# EAGLE design OptronV7_PCB (EAGLE 9.5.1)
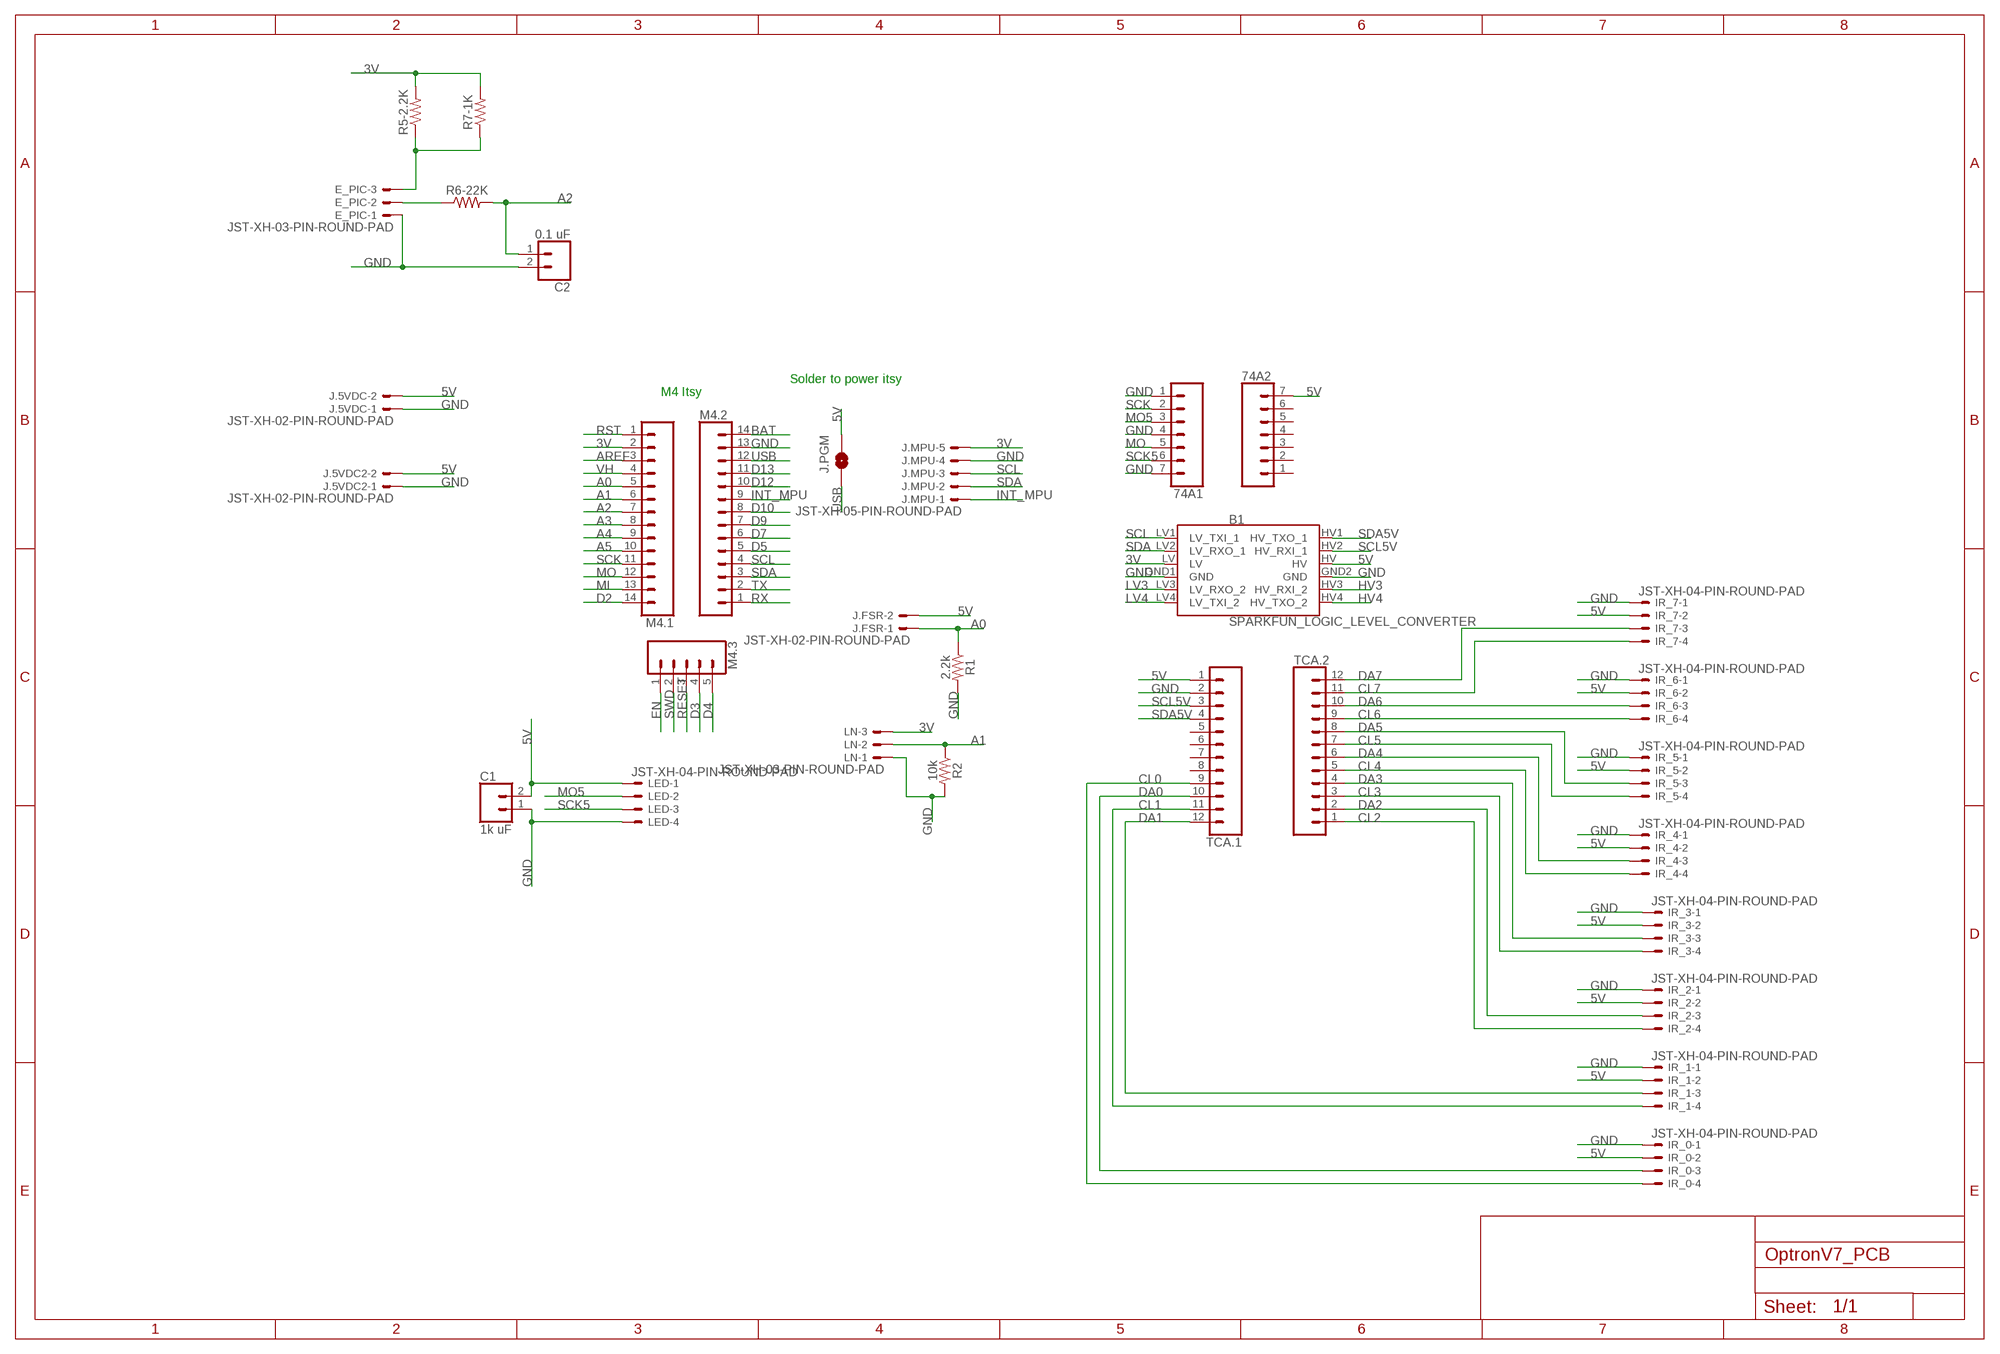
[diagram p0: schematic, sheet 1]

## Parts
74A1  CONN_07  [1X07]
74A2  CONN_07  [1X07]
B1  SPARKFUN_LOGIC_LEVEL_CONVERTER  [SPARKFUN_LOGIC_LEVEL_CONVERTER]
C1  1k uF  CONN_02  [1X02]
C2  0.1 uF  CONN_02  [1X02]
E_PIC  JST-XH-03-PIN-ROUND-PAD  [JST-XH-03-PACKAGE-ROUND-PAD]
IR_0  JST-XH-04-PIN-ROUND-PAD  [JST-XH-04-PACKAGE-ROUND-PAD]
IR_1  JST-XH-04-PIN-ROUND-PAD  [JST-XH-04-PACKAGE-ROUND-PAD]
IR_2  JST-XH-04-PIN-ROUND-PAD  [JST-XH-04-PACKAGE-ROUND-PAD]
IR_3  JST-XH-04-PIN-ROUND-PAD  [JST-XH-04-PACKAGE-ROUND-PAD]
IR_4  JST-XH-04-PIN-ROUND-PAD  [JST-XH-04-PACKAGE-ROUND-PAD]
IR_5  JST-XH-04-PIN-ROUND-PAD  [JST-XH-04-PACKAGE-ROUND-PAD]
IR_6  JST-XH-04-PIN-ROUND-PAD  [JST-XH-04-PACKAGE-ROUND-PAD]
IR_7  JST-XH-04-PIN-ROUND-PAD  [JST-XH-04-PACKAGE-ROUND-PAD]
J.5VDC  JST-XH-02-PIN-ROUND-PAD  [JST-XH-02-PACKAGE-ROUND-PAD]
J.5VDC2  JST-XH-02-PIN-ROUND-PAD  [JST-XH-02-PACKAGE-ROUND-PAD]
J.FSR  JST-XH-02-PIN-ROUND-PAD  [JST-XH-02-PACKAGE-ROUND-PAD]
J.MPU  JST-XH-05-PIN-ROUND-PAD  [JST-XH-05-PACKAGE-ROUND-PAD]
J.PGM  JUMPER-SMT_2_NO_NO-SILK  [SMT-JUMPER_2_NO_NO-SILK]
LED  JST-XH-04-PIN-ROUND-PAD  [JST-XH-04-PACKAGE-ROUND-PAD]
LN  JST-XH-03-PIN-ROUND-PAD  [JST-XH-03-PACKAGE-ROUND-PAD]
M4.1  CONN_14  [1X14]
M4.2  CONN_14  [1X14]
M4.3  CONN_05  [1X05]
R1  2.2k  10KOHM-HORIZ-1/4W-5%  [AXIAL-0.3]
R2  10k  10KOHM-HORIZ-1/4W-5%  [AXIAL-0.3]
R5-2.2K  RESISTORAXIAL-0.3  [AXIAL-0.3]
R6-22K  RESISTORAXIAL-0.3  [AXIAL-0.3]
R7-1K  RESISTORAXIAL-0.3  [AXIAL-0.3]
TCA.1  CONN_12  [1X12]
TCA.2  CONN_12  [1X12]

## Nets
3V: B1.LV J.MPU.5 LN.3 M4.1.2 R5-2.2K.P$2 R7-1K.P$2
5V: 74A2.7 B1.HV C1.2 IR_0.2 IR_1.2 IR_2.2 IR_3.2 IR_4.2 IR_5.2 IR_6.2 IR_7.2 J.5VDC2.2 J.5VDC.2 J.FSR.2 J.PGM.2 LED.1 TCA.1.1
A0: J.FSR.1 M4.1.5 R1.P$1
A1: LN.2 M4.1.6 R2.P$1
A2: C2.1 M4.1.7 R6-22K.P$2
A3: M4.1.8
A4: M4.1.9
A5: M4.1.10
AREF: M4.1.3
BAT: M4.2.14
CL0: IR_0.4 TCA.1.9
CL1: IR_1.4 TCA.1.11
CL2: IR_2.4 TCA.2.1
CL3: IR_3.4 TCA.2.3
CL4: IR_4.4 TCA.2.5
CL5: IR_5.4 TCA.2.7
CL6: IR_6.4 TCA.2.9
CL7: IR_7.4 TCA.2.11
D2: M4.1.14
D3: M4.3.4
D4: M4.3.5
D5: M4.2.5
D7: M4.2.6
D9: M4.2.7
D10: M4.2.8
D12: M4.2.10
D13: M4.2.11
DA0: IR_0.3 TCA.1.10
DA1: IR_1.3 TCA.1.12
DA2: IR_2.3 TCA.2.2
DA3: IR_3.3 TCA.2.4
DA4: IR_4.3 TCA.2.6
DA5: IR_5.3 TCA.2.8
DA6: IR_6.3 TCA.2.10
DA7: IR_7.3 TCA.2.12
EN: M4.3.1
GND: 74A1.1 74A1.4 74A1.7 B1.GND1(GND) B1.GND2(GND) C1.1 C2.2 E_PIC.1 IR_0.1 IR_1.1 IR_2.1 IR_3.1 IR_4.1 IR_5.1 IR_6.1 IR_7.1 J.5VDC2.1 J.5VDC.1 J.MPU.4 LED.4 LN.1 M4.2.13 R1.P$2 R2.P$2 TCA.1.2
HV3: B1.HV3(HV_RXI_2)
HV4: B1.HV4(HV_TXO_2)
INT_MPU: J.MPU.1 M4.2.9
LV3: B1.LV3(LV_RXO_2)
LV4: B1.LV4(LV_TXI_2)
MI: M4.1.13
MO: 74A1.5 M4.1.12
MO5: 74A1.3 LED.2
N$2: E_PIC.3 R5-2.2K.P$1 R7-1K.P$1
N$3: E_PIC.2 R6-22K.P$1
RESET: M4.3.3
RST: M4.1.1
RX: M4.2.1
SCK: 74A1.2 M4.1.11
SCK5: 74A1.6 LED.3
SCL: B1.LV1(LV_TXI_1) J.MPU.3 M4.2.4
SCL5V: B1.HV2(HV_RXI_1) TCA.1.3
SDA: B1.LV2(LV_RXO_1) J.MPU.2 M4.2.3
SDA5V: B1.HV1(HV_TXO_1) TCA.1.4
SWD: M4.3.2
TX: M4.2.2
USB: J.PGM.1 M4.2.12
VH: M4.1.4
Unconnected: 74A2.1 74A2.2 74A2.3 74A2.4 74A2.5 74A2.6 TCA.1.5 TCA.1.6 TCA.1.7 TCA.1.8

## Notes on the sheet
- Solder to power itsy
- M4 Itsy

## Library data of the parts
74A1 74A2 = SparkFun-Connectors:CONN_07: Multi connection point. Often used as Generic Header-pin footprint for 0.1 inch spaced/style header connections On any of the 0.1 inch spaced packages, you can populate with these: Break Away Headers - Straight <https://www.sparkfun.com/products/116> (PRT-00116) Break Away Male Headers - Right Angle <https://www.sparkfun.com/products/553> (PRT-00553) Female Headers <https://www.sparkfun.com/products/115> (PRT-00115) Break Away Headers - Machine Pin <https://www.sparkfun.com/products/117> (PRT-00117) Break Away Female Headers - Swiss Machine Pin <https://www.sparkfun.com/products/743> (PRT-00743) For SCREWTERMINALS and SPRING TERMINALS visit here: Screw Terimnals on SparkFun.com <https://www.sparkfun.com/search/results?term=Screw+Terminals> (5mm/3.5mm/2.54mm spacing) This device is also useful as a general connection point to wire up your design to another part of your project. Our various solder wires solder well into these plated through hole pads. Hook-Up Wire - Assortment (Stranded, 22 AWG) <https://www.sparkfun.com/products/11375> (PRT-11375) Hook-Up Wire - Assortment (Solid Core, 22 AWG) <https://www.sparkfun.com/products/11367> (PRT-11367) View the entire wire category on our website here <https://www.sparkfun.com/categories/141> Special notes: Molex polarized connector foot print use with SKU : PRT-08231 with associated crimp pins and housings. 1MM SMD Version SKU: PRT-10208 NOTES ON THE VARIANTS LOCK and LOCK_LONGPADS... This footprint was designed to help hold the alignment of a through-hole component (i.e. 6-pin header) while soldering it into place. You may notice that each hole has been shifted either up or down by 0.005 of an inch from it's more standard position (which is a perfectly straight line). This slight alteration caused the pins (the squares in the middle) to touch the edges of the holes. Because they are alternating, it causes a "brace" to hold the component in place. 0.005 has proven to be the perfect amount of "off-center" position when using our standard breakaway headers. Although looks a little odd when you look at the bare footprint, once you have a header in there, the alteration is very hard to notice. Also,if you push a header all the way into place, it is covered up entirely on the bottom side.
B1 = SparkFun-Boards:SPARKFUN_LOGIC_LEVEL_CONVERTER: SparkFun Logic Level Converter -Bi-Directional This is the mechnical outline for the 3.3V - 5V bi directional logic level converter. *Note, the "LOCK" Package has the header pins staggered by an offset of 5 mils (off center line), so that when you slide a row of standard 0.1" headers into the PTH pads, it will hold position vertically. See the follwing turorial for more information on this type of special footprints: Sneaky Footprints <https://www.sparkfun.com/tutorials/114> SparkFun Products: SparkFun Logic Level Converter - Bi-Directional <https://www.sparkfun.com/products/12009>
C1 C2 = SparkFun-Connectors:CONN_02: Multi connection point. Often used as Generic Header-pin footprint for 0.1 inch spaced/style header connections On any of the 0.1 inch spaced packages, you can populate with these: Break Away Headers - Straight <https://www.sparkfun.com/products/116> (PRT-00116) Break Away Male Headers - Right Angle <https://www.sparkfun.com/products/553> (PRT-00553) Female Headers <https://www.sparkfun.com/products/115> (PRT-00115) Break Away Headers - Machine Pin <https://www.sparkfun.com/products/117> (PRT-00117) Break Away Female Headers - Swiss Machine Pin <https://www.sparkfun.com/products/743> (PRT-00743) For SCREWTERMINALS and SPRING TERMINALS visit here: Screw Terimnals on SparkFun.com <https://www.sparkfun.com/search/results?term=Screw+Terminals> (5mm/3.5mm/2.54mm spacing) This device is also useful as a general connection point to wire up your design to another part of your project. Our various solder wires solder well into these plated through hole pads. Hook-Up Wire - Assortment (Stranded, 22 AWG) <https://www.sparkfun.com/products/11375> (PRT-11375) Hook-Up Wire - Assortment (Solid Core, 22 AWG) <https://www.sparkfun.com/products/11367> (PRT-11367) View the entire wire category on our website here <https://www.sparkfun.com/categories/141> Special notes: Molex polarized connector foot print use with: PRT-08233 with associated crimp pins and housings. 2.54_SCREWTERM for use with PRT-10571. 3.5mm Screw Terminal footprints for PRT-08084 5mm Screw Terminal footprints for use with PRT-08432
E_PIC LN = Rembrandt Electronics - JST XH Connectors v1-0:JST-XH-03-PIN: JST XH Connector 2 Pin Wire to board connector. Pitch: 2,54 mm, (0.100") Number of pins: 3 Created by Rembrandt Electronics www.rembrandtelectronics.com
IR_0 IR_1-IR_7 LED = Rembrandt Electronics - JST XH Connectors v1-0:JST-XH-04-PIN: JST XH Connector 2 Pin Wire to board connector. Pitch: 2,54 mm, (0.100") Number of pins: 4 Created by Rembrandt Electronics www.rembrandtelectronics.com
J.5VDC J.5VDC2 J.FSR = Rembrandt Electronics - JST XH Connectors v1-0:JST-XH-02-PIN: JST XH Connector 2 Pin Wire to board connector. Pitch: 2,54 mm, (0.100") Number of pins: 2 Created by Rembrandt Electronics www.rembrandtelectronics.com
J.MPU = Rembrandt Electronics - JST XH Connectors v1-0:JST-XH-05-PIN: JST XH Connector 2 Pin Wire to board connector. Pitch: 2,54 mm, (0.100") Number of pins: 5 Created by Rembrandt Electronics www.rembrandtelectronics.com
J.PGM = SparkFun-Jumpers:JUMPER-SMT_2_NO: Normally open jumper This jumper has two pads in close proximity to each other. Apply solder to close the connection. Round pads are easier to solder for beginners, but are a lot larger. SparkFun Product that uses the round pads: SparkFun EL Sequencer <https://www.sparkfun.com/products/12781>
M4.1 M4.2 = SparkFun-Connectors:CONN_14: Multi connection point. Often used as Generic Header-pin footprint for 0.1 inch spaced/style header connections On any of the 0.1 inch spaced packages, you can populate with these: Break Away Headers - Straight <https://www.sparkfun.com/products/116> (PRT-00116) Break Away Male Headers - Right Angle <https://www.sparkfun.com/products/553> (PRT-00553) Female Headers <https://www.sparkfun.com/products/115> (PRT-00115) Break Away Headers - Machine Pin <https://www.sparkfun.com/products/117> (PRT-00117) Break Away Female Headers - Swiss Machine Pin <https://www.sparkfun.com/products/743> (PRT-00743) For SCREWTERMINALS and SPRING TERMINALS visit here: Screw Terimnals on SparkFun.com <https://www.sparkfun.com/search/results?term=Screw+Terminals> (5mm/3.5mm/2.54mm spacing) This device is also useful as a general connection point to wire up your design to another part of your project. Our various solder wires solder well into these plated through hole pads. Hook-Up Wire - Assortment (Stranded, 22 AWG) <https://www.sparkfun.com/products/11375> (PRT-11375) Hook-Up Wire - Assortment (Solid Core, 22 AWG) <https://www.sparkfun.com/products/11367> (PRT-11367) View the entire wire category on our website here <https://www.sparkfun.com/categories/141> Special notes: Molex polarized connector foot print use with SKU : PRT-08231 with associated crimp pins and housings. 1MM SMD Version SKU: PRT-10208 NOTES ON THE VARIANTS LOCK and LOCK_LONGPADS... This footprint was designed to help hold the alignment of a through-hole component (i.e. 6-pin header) while soldering it into place. You may notice that each hole has been shifted either up or down by 0.005 of an inch from it's more standard position (which is a perfectly straight line). This slight alteration caused the pins (the squares in the middle) to touch the edges of the holes. Because they are alternating, it causes a "brace" to hold the component in place. 0.005 has proven to be the perfect amount of "off-center" position when using our standard breakaway headers. Although looks a little odd when you look at the bare footprint, once you have a header in there, the alteration is very hard to notice. Also,if you push a header all the way into place, it is covered up entirely on the bottom side.
M4.3 = SparkFun-Connectors:CONN_05: Multi connection point. Often used as Generic Header-pin footprint for 0.1 inch spaced/style header connections On any of the 0.1 inch spaced packages, you can populate with these: Break Away Headers - Straight <https://www.sparkfun.com/products/116> (PRT-00116) Break Away Male Headers - Right Angle <https://www.sparkfun.com/products/553> (PRT-00553) Female Headers <https://www.sparkfun.com/products/115> (PRT-00115) Break Away Headers - Machine Pin <https://www.sparkfun.com/products/117> (PRT-00117) Break Away Female Headers - Swiss Machine Pin <https://www.sparkfun.com/products/743> (PRT-00743) For SCREWTERMINALS and SPRING TERMINALS visit here: Screw Terimnals on SparkFun.com <https://www.sparkfun.com/search/results?term=Screw+Terminals> (5mm/3.5mm/2.54mm spacing) This device is also useful as a general connection point to wire up your design to another part of your project. Our various solder wires solder well into these plated through hole pads. Hook-Up Wire - Assortment (Stranded, 22 AWG) <https://www.sparkfun.com/products/11375> (PRT-11375) Hook-Up Wire - Assortment (Solid Core, 22 AWG) <https://www.sparkfun.com/products/11367> (PRT-11367) View the entire wire category on our website here <https://www.sparkfun.com/categories/141> Special notes: Molex polarized connector foot print use with SKU : PRT-08231 with associated crimp pins and housings. 1MM SMD Version SKU: PRT-10208
R1 = SparkFun-Resistors:10KOHM: 10kΩ resistor A resistor is a passive two-terminal electrical component that implements electrical resistance as a circuit element. Resistors act to reduce current flow, and, at the same time, act to lower voltage levels within circuits. - Wikipedia; PROD_ID: RES-09435; VALUE: 10k
R2 = SparkFun-Resistors:10KOHM: 10kΩ resistor A resistor is a passive two-terminal electrical component that implements electrical resistance as a circuit element. Resistors act to reduce current flow, and, at the same time, act to lower voltage levels within circuits. - Wikipedia; PROD_ID: RES-09435
R5-2.2K R6-22K R7-1K = SparkFun-Resistors:RESISTOR: Generic Resistor Package
TCA.1 TCA.2 = SparkFun-Connectors:CONN_12: Multi connection point. Often used as Generic Header-pin footprint for 0.1 inch spaced/style header connections On any of the 0.1 inch spaced packages, you can populate with these: Break Away Headers - Straight <https://www.sparkfun.com/products/116> (PRT-00116) Break Away Male Headers - Right Angle <https://www.sparkfun.com/products/553> (PRT-00553) Female Headers <https://www.sparkfun.com/products/115> (PRT-00115) Break Away Headers - Machine Pin <https://www.sparkfun.com/products/117> (PRT-00117) Break Away Female Headers - Swiss Machine Pin <https://www.sparkfun.com/products/743> (PRT-00743) For SCREWTERMINALS and SPRING TERMINALS visit here: Screw Terimnals on SparkFun.com <https://www.sparkfun.com/search/results?term=Screw+Terminals> (5mm/3.5mm/2.54mm spacing) This device is also useful as a general connection point to wire up your design to another part of your project. Our various solder wires solder well into these plated through hole pads. Hook-Up Wire - Assortment (Stranded, 22 AWG) <https://www.sparkfun.com/products/11375> (PRT-11375) Hook-Up Wire - Assortment (Solid Core, 22 AWG) <https://www.sparkfun.com/products/11367> (PRT-11367) View the entire wire category on our website here <https://www.sparkfun.com/categories/141> Special notes: Molex polarized connector foot print use with SKU : PRT-08231 with associated crimp pins and housings. 1MM SMD Version SKU: PRT-10208 NOTES ON THE VARIANTS LOCK and LOCK_LONGPADS... This footprint was designed to help hold the alignment of a through-hole component (i.e. 6-pin header) while soldering it into place. You may notice that each hole has been shifted either up or down by 0.005 of an inch from it's more standard position (which is a perfectly straight line). This slight alteration caused the pins (the squares in the middle) to touch the edges of the holes. Because they are alternating, it causes a "brace" to hold the component in place. 0.005 has proven to be the perfect amount of "off-center" position when using our standard breakaway headers. Although looks a little odd when you look at the bare footprint, once you have a header in there, the alteration is very hard to notice. Also,if you push a header all the way into place, it is covered up entirely on the bottom side.

## Board
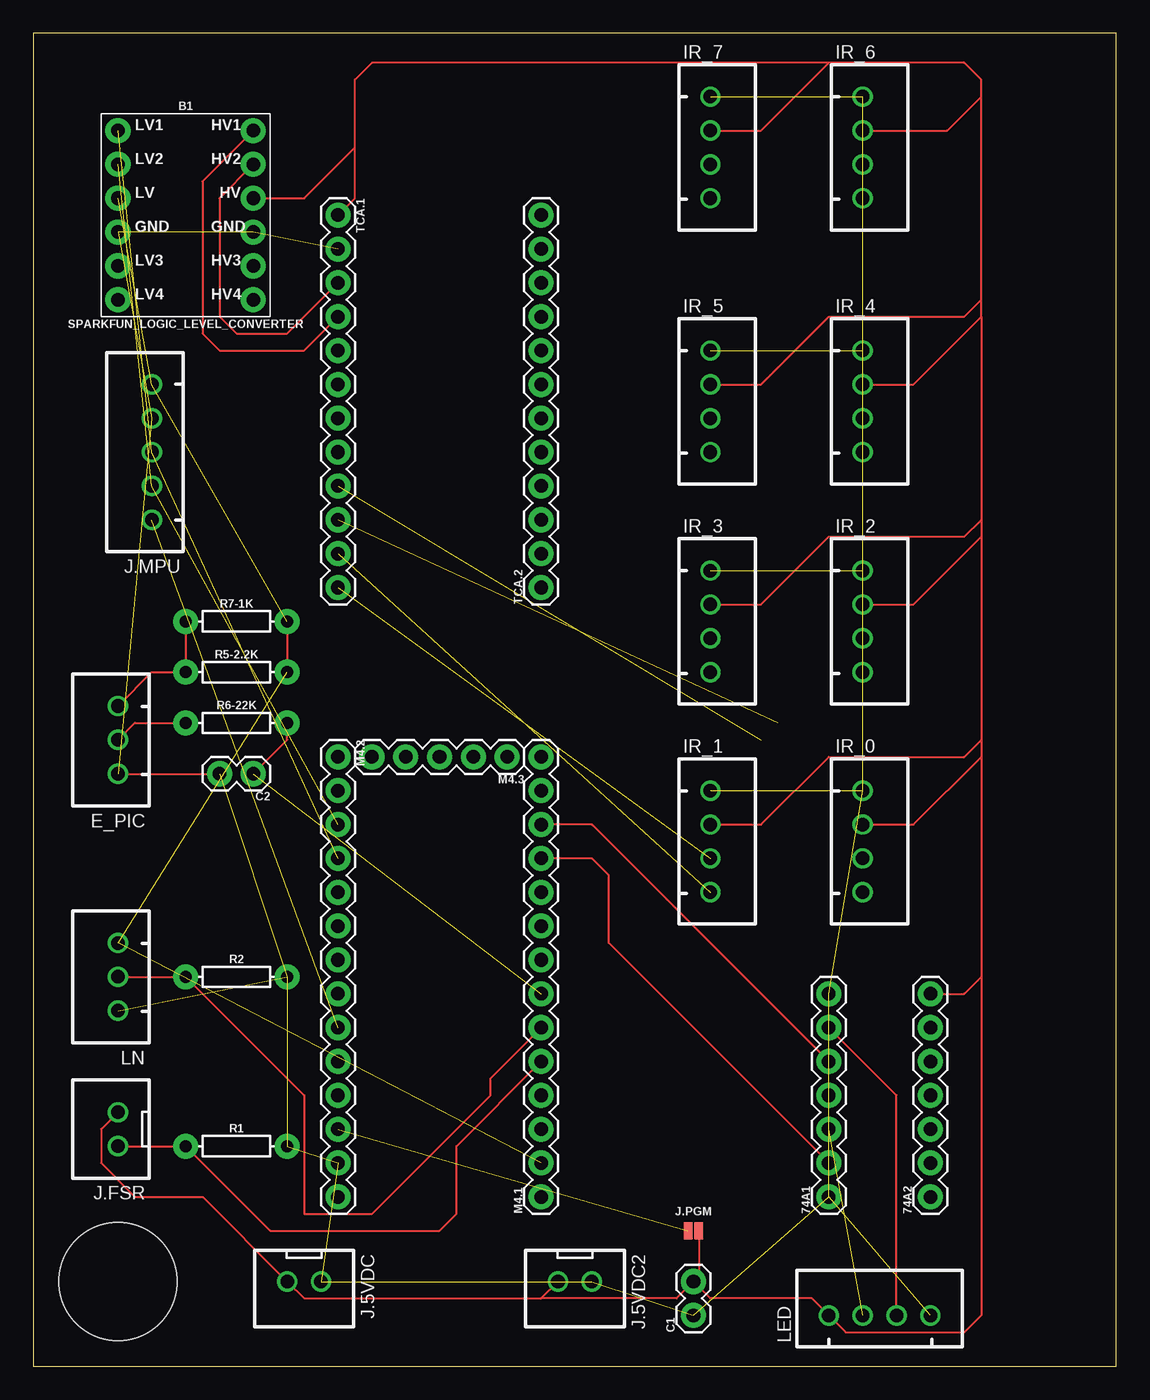
[diagram p1: board, top side]
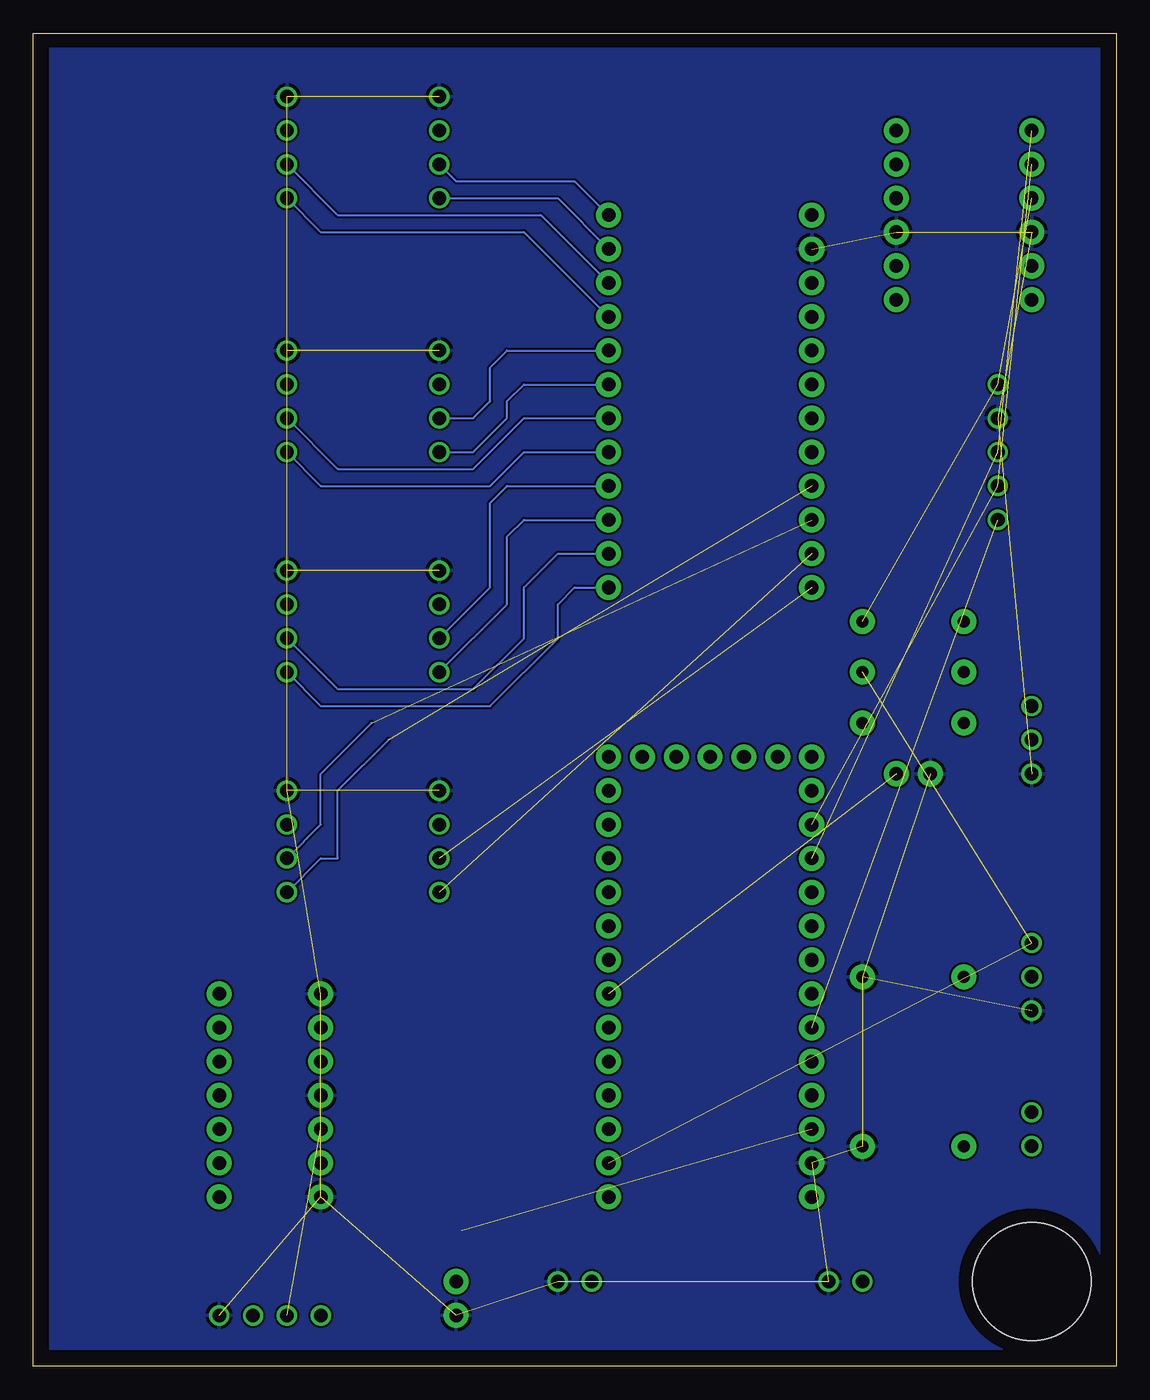
[diagram p2: board, bottom side, seen from below]

Size 81.26 x 100 mm. Coordinates in mm from the lower left corner, seen from the top.
Outline: 0,0 81.26,0 81.26,100 0,100 0,0
Copper layers (1*16): Top 0.035mm / dielectric 1.5mm / Bottom 0.035mm
Design rules "default": minimum track width 6mil, minimum drill 0.35mm, track to track 6mil, track to pad 6mil, pad to pad 6mil, via to via 6mil, smd to smd 6mil, copper to edge 40mil, drill to drill 6mil, minimum pad ring 10mil, minimum via ring 8mil, stop-mask expansion 4mil, vias tented up to drill 0mil, thermal gap 10mil
Holes 8.89 mm at 6.35,6.35

### Footprints (pad centres in the part's own frame; a part is rotated, then mirrored left to right if it is on the bottom)
1X07 = drill 1.016 pad 1.88: 1 0,0; 2 2.54,0; 3 5.08,0; 4 7.62,0; 5 10.16,0; 6 12.7,0; 7 15.24,0
SPARKFUN_LOGIC_LEVEL_CONVERTER = drill 1.016 pad 1.88: GND1 -5.08,-1.27; GND2 5.08,-1.27; HV 5.08,1.27; HV1 5.08,6.35; HV2 5.08,3.81; HV3 5.08,-3.81; HV4 5.08,-6.35; LV -5.08,1.27; LV1 -5.08,6.35; LV2 -5.08,3.81; LV3 -5.08,-3.81; LV4 -5.08,-6.35
1X02 = drill 1.016 pad 1.88: 1 0,0; 2 2.54,0
JST-XH-03-PACKAGE-ROUND-PAD = drill 1.016: 1 -2.54,0; 2 0,0; 3 2.54,0
JST-XH-04-PACKAGE-ROUND-PAD = drill 1.016: 1 -3.81,0; 2 -1.27,0; 3 1.27,0; 4 3.81,0
JST-XH-02-PACKAGE-ROUND-PAD = drill 1.016: 1 -1.27,0; 2 1.27,0
JST-XH-05-PACKAGE-ROUND-PAD = drill 1.016: 1 -5.08,0; 2 -2.54,0; 3 0,0; 4 2.54,0; 5 5.08,0
SMT-JUMPER_2_NO_NO-SILK = smd 0.635 x 1.27: 1 -0.406,0; 2 0.406,0
1X14 = drill 1.016 pad 1.88: 1 0,0; 2 2.54,0; 3 5.08,0; 4 7.62,0; 5 10.16,0; 6 12.7,0; 7 15.24,0; 8 17.78,0; 9 20.32,0; 10 22.86,0; 11 25.4,0; 12 27.94,0; 13 30.48,0; 14 33.02,0
1X05 = drill 1.016 pad 1.88: 1 0,0; 2 2.54,0; 3 5.08,0; 4 7.62,0; 5 10.16,0
AXIAL-0.3 = drill 0.9 pad 1.88: P$1 -3.81,0; P$2 3.81,0
1X12 = drill 1.016 pad 1.88: 1 0,0; 2 2.54,0; 3 5.08,0; 4 7.62,0; 5 10.16,0; 6 12.7,0; 7 15.24,0; 8 17.78,0; 9 20.32,0; 10 22.86,0; 11 25.4,0; 12 27.94,0

### Placement (x,y rotation side)
74A1  59.69,12.7 90 top
74A2  67.31,12.7 90 top
B1  11.43,86.36 0 top
C1  49.53,3.81 90 top
C2  16.51,44.45 180 top
E_PIC  6.35,46.99 90 top
IR_0  62.23,39.37 270 top
IR_1  50.8,39.37 270 top
IR_2  62.23,55.88 270 top
IR_3  50.8,55.88 270 top
IR_4  62.23,72.39 270 top
IR_5  50.8,72.39 270 top
IR_6  62.23,91.44 270 top
IR_7  50.8,91.44 270 top
J.5VDC  20.32,6.35 180 top
J.5VDC2  40.64,6.35 180 top
J.FSR  6.35,17.78 90 top
J.MPU  8.89,68.58 90 top
J.PGM  49.53,10.16 0 top
LED  63.5,3.81 0 top
LN  6.35,29.21 90 top
M4.1  38.1,12.7 90 top
M4.2  22.86,45.72 270 top
M4.3  35.56,45.72 180 top
R1  15.24,16.51 0 top
R2  15.24,29.21 0 top
R5-2.2K  15.24,52.07 0 top
R6-22K  15.24,48.26 0 top
R7-1K  15.24,55.88 0 top
TCA.1  22.86,86.36 270 top
TCA.2  38.1,58.42 90 top

### Tracks (layer width: path | path; a pad name or v marks a point on that pad's centre or on a via)
3V  (4 unrouted)
  Top 0.152: R7-1K.P$2 R5-2.2K.P$2
5V
  Top 0.152: 71.12,78.74 71.12,63.5 | 71.12,63.5 71.12,62.23 | 71.12,62.23 71.12,46.99 | 71.12,46.99 71.12,45.72 | 71.12,45.72 71.12,29.21 | 71.12,29.21 71.12,3.81 69.85,2.54 60.96,2.54 LED.1 58.42,5.08 50.8,5.08 C1.2 | 59.69,97.79 54.61,92.71 IR_7.2 | 59.69,97.79 25.4,97.79 24.13,96.52 24.13,91.44 | TCA.1.1 24.13,87.63 24.13,91.44 | B1.HV 20.32,87.63 24.13,91.44 | 38.1,5.08 20.32,5.08 J.5VDC.2 12.7,12.7 7.62,12.7 5.08,15.24 5.08,17.78 J.FSR.2 | 38.1,5.08 J.5VDC2.2 | C1.2 48.26,5.08 38.1,5.08 | J.PGM.2 49.94,6.76 C1.2 | IR_5.2 54.61,73.66 59.69,78.74 69.85,78.74 71.12,80.01 | IR_4.2 66.04,73.66 71.12,78.74 | IR_3.2 54.61,57.15 59.69,62.23 69.85,62.23 71.12,63.5 | IR_2.2 66.04,57.15 71.12,62.23 | 71.12,78.74 71.12,80.01 | 71.12,80.01 71.12,95.25 | 71.12,95.25 71.12,96.52 69.85,97.79 59.69,97.79 | 71.12,95.25 68.58,92.71 IR_6.2 | 74A2.7 69.85,27.94 71.12,29.21 | IR_1.2 54.61,40.64 59.69,45.72 69.85,45.72 71.12,46.99 | IR_0.2 66.04,40.64 71.12,45.72
A0
  Top 0.152: J.FSR.1 R1.P$1 17.78,10.16 30.48,10.16 31.75,11.43 31.75,16.51 M4.1.5
A1
  Top 0.152: LN.2 R2.P$1 20.32,20.32 20.32,11.43 25.4,11.43 34.29,20.32 34.29,21.59 M4.1.6
A2  (1 unrouted)
  Top 0.152: C2.1 19.05,46.99 R6-22K.P$2
CL0  (1 unrouted)
  Bottom 0.152: IR_0.4 59.69,38.1 58.42,38.1 58.42,43.18 54.61,46.99
CL1  (1 unrouted)
CL2
  Bottom 0.152: IR_2.4 59.69,49.53 46.99,49.53 41.91,54.61 41.91,57.15 40.64,58.42 TCA.2.1
CL3
  Bottom 0.152: IR_3.4 45.72,57.15 45.72,62.23 44.45,63.5 TCA.2.3
CL4
  Bottom 0.152: IR_4.4 59.69,66.04 46.99,66.04 44.45,68.58 TCA.2.5
CL5
  Bottom 0.152: IR_5.4 48.26,68.58 45.72,71.12 45.72,72.39 44.45,73.66 TCA.2.7
CL6
  Bottom 0.152: IR_6.4 59.69,85.09 44.45,85.09 TCA.2.9
CL7
  Bottom 0.152: IR_7.4 41.91,87.63 TCA.2.11
DA0  (1 unrouted)
  Bottom 0.152: IR_0.3 59.69,40.64 59.69,44.45 55.88,48.26
DA1  (1 unrouted)
DA2
  Bottom 0.152: IR_2.3 58.42,50.8 48.26,50.8 44.45,54.61 44.45,58.42 41.91,60.96 TCA.2.2
DA3
  Bottom 0.152: IR_3.3 46.99,58.42 46.99,64.77 45.72,66.04 TCA.2.4
DA4
  Bottom 0.152: IR_4.3 58.42,67.31 48.26,67.31 44.45,71.12 TCA.2.6
DA5
  Bottom 0.152: IR_5.3 48.26,71.12 46.99,72.39 46.99,74.93 45.72,76.2 TCA.2.8
DA6
  Bottom 0.152: IR_6.3 58.42,86.36 43.18,86.36 TCA.2.10
DA7
  Bottom 0.152: IR_7.3 49.53,88.9 40.64,88.9 TCA.2.12
GND  (23 unrouted)
  Top 0.152: E_PIC.1 C2.2
  pour Bottom: 1.27,99.06 1.27,1.27 80.01,1.27 80.01,99.06
INT_MPU  (1 unrouted)
MO
  Top 0.152: 74A1.5 41.91,40.64 M4.1.12
MO5  (1 unrouted)
N$2
  Top 0.152: R7-1K.P$1 R5-2.2K.P$1 8.89,52.07 E_PIC.3
N$3
  Top 0.152: E_PIC.2 7.62,48.26 R6-22K.P$1
SCK
  Top 0.152: 74A1.2 43.18,31.75 43.18,36.83 41.91,38.1 M4.1.11
SCK5
  Top 0.152: LED.3 64.77,20.32 74A1.6
SCL  (2 unrouted)
SCL5V
  Top 0.152: B1.HV2 13.97,87.63 13.97,78.74 15.24,77.47 19.05,77.47 TCA.1.3
SDA  (2 unrouted)
SDA5V
  Top 0.152: B1.HV1 12.7,88.9 12.7,77.47 13.97,76.2 20.32,76.2 TCA.1.4
USB  (1 unrouted)